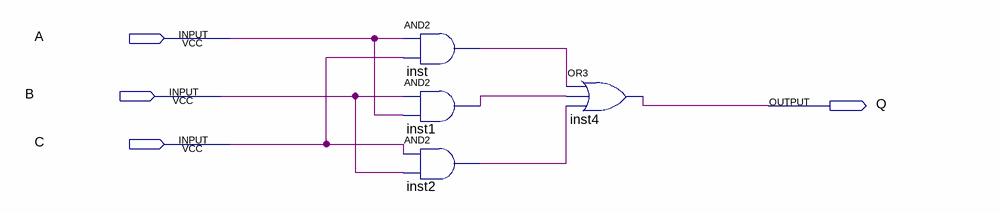
[diagram p0: schematic sheet]
// Quartus schematic halfaddertest.bdf as structural Verilog: 4 symbols, 4 pins
module halfaddertest (
  input  A,
  input  B,
  input  C,
  output Q
);

  wire inst1_out, inst2_out, inst_out;

  and inst (inst_out, A, C);
  and inst1 (inst1_out, B, A);
  and inst2 (inst2_out, C, B);
  or inst4 (Q, inst_out, inst1_out, inst2_out);
endmodule
